# EAGLE design schematic (EAGLE 9.6.2)
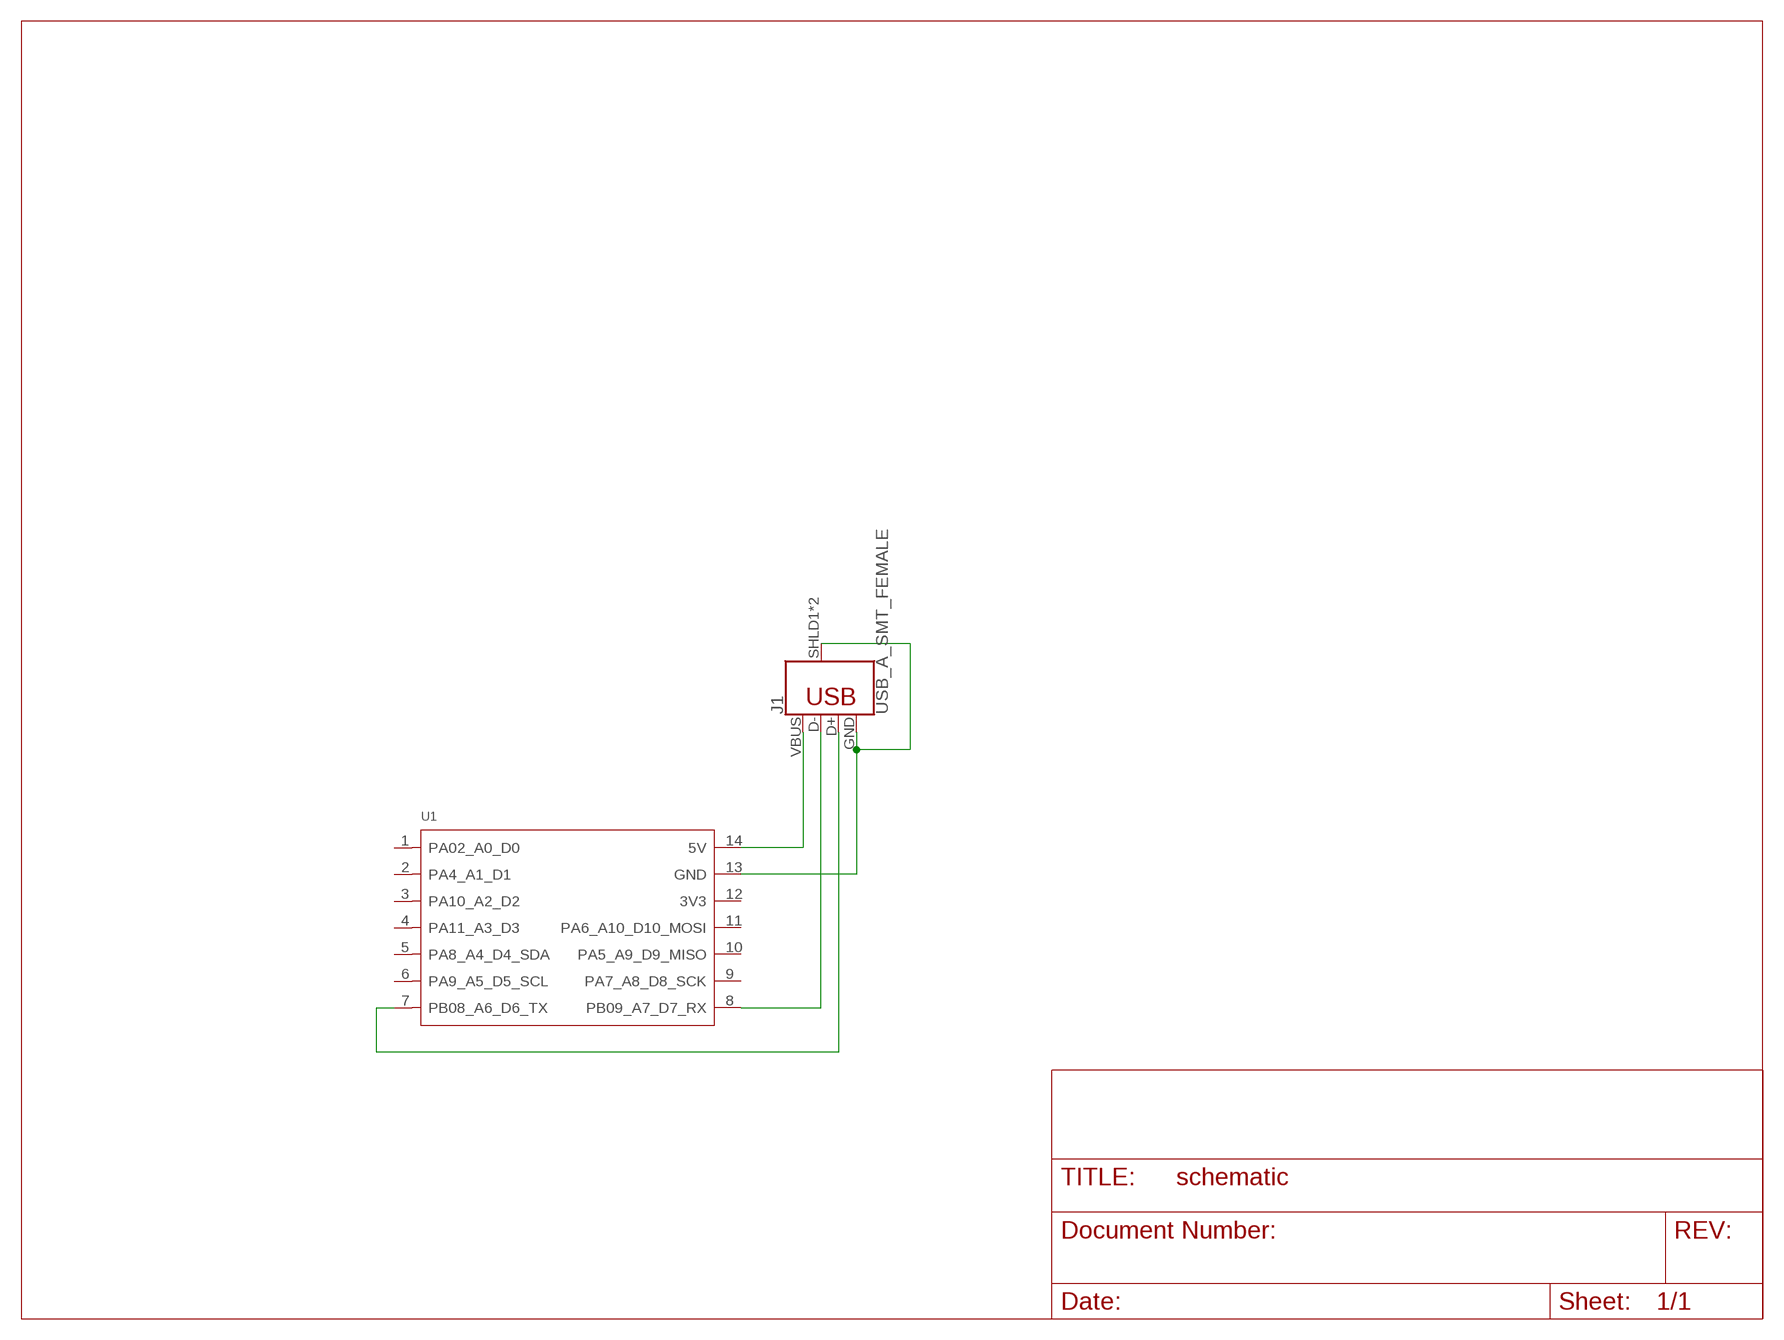
[diagram p0: schematic, sheet 1]

## Parts
J1  USB_A_SMT_FEMALE  [USB-A-S-SILK-FEMALE]
U1  MOUDLE-SEEEDUINO-XIAO  [MOUDLE14P-2.54-21X17.8MM]

## Nets
DATA_N [diff pairs]: J1.D- U1.8(PB09_A7_D7_RX)
DATA_P [diff pairs]: J1.D+ U1.7(PB08_A6_D6_TX)
GND [diff pairs]: J1.GND J1.SHLD1(SHIELD) J1.SHLD2(SHIELD) U1.13(GND)
VCC: J1.VBUS U1.14(5V)
Unconnected: U1.1(PA02_A0_D0) U1.2(PA4_A1_D1) U1.3(PA10_A2_D2) U1.4(PA11_A3_D3) U1.5(PA8_A4_D4_SDA) U1.6(PA9_A5_D5_SCL) U1.9(PA7_A8_D8_SCK) U1.10(PA5_A9_D9_MISO) U1.11(PA6_A10_D10_MOSI) U1.12(3V3)

## Library data of the parts
J1 = SparkFun-Connectors:USB_A: USB-A Connector Male and female variants, as well as PTH and SMT variants SparkFun Products: SparkFun XBee Explorer Dongle <https://www.sparkfun.com/products/11697> PTH Male SparkFun MicroView-USB Programmer <https://www.sparkfun.com/products/12924> SMT Male SparkFun USB Type A Female Breakout <https://www.sparkfun.com/products/12700> SMT Female; PROD_ID: CONN-09520; SF_ID: PRT-09011
U1 = Seeeduino XIAO:MOUDLE-SEEEDUINO-XIAO

## Net classes
1 diff pairs: width 0.406 mm

## Board
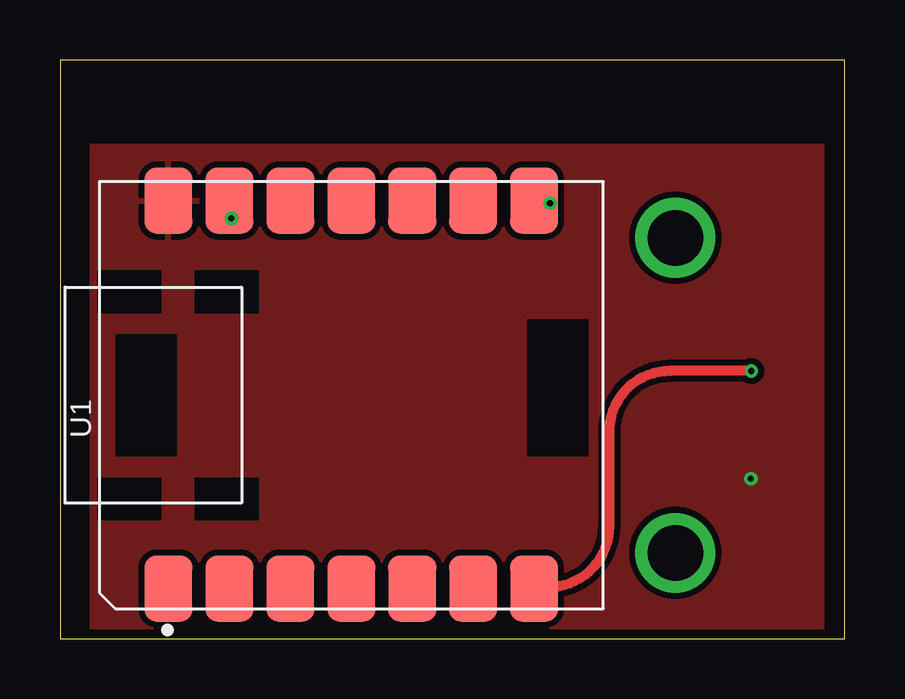
[diagram p1: board, top side]
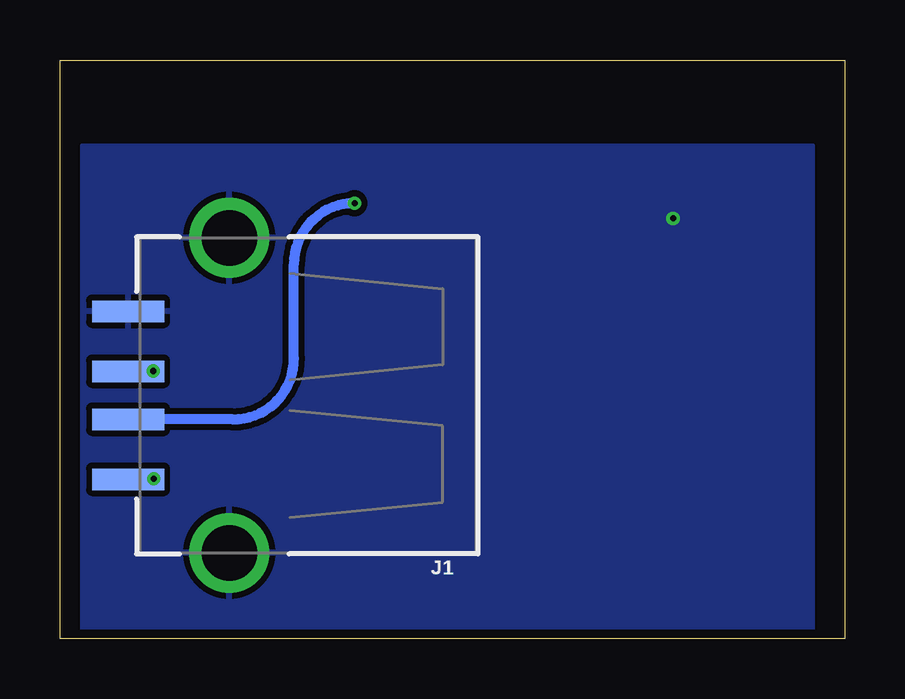
[diagram p2: board, bottom side, seen from below]

Size 32.69 x 24.12 mm. Coordinates in mm from the lower left corner, seen from the top.
Outline: 0,0 32.69,0 32.69,24.12 0,24.12 0,0
Copper layers (1*16): Top 0.035559375mm / dielectric 1.6mm / Bottom 0.035559375mm
Design rules "oshpark-2layer-auto-routing *": minimum track width 10mil, minimum drill 10mil, track to track 10mil, track to pad 8mil, pad to pad 8mil, via to via 8mil, smd to smd 6mil, copper to edge 15mil, drill to drill 6mil, minimum pad ring 6mil, minimum via ring 6mil, stop-mask expansion 2.5mil, vias tented up to drill 40mil, thermal gap 10mil

### Footprints (pad centres in the part's own frame; a part is rotated, then mirrored left to right if it is on the bottom)
USB-A-S-SILK-FEMALE = smd 3 x 0.9: D+ 7.212,-1; D- 7.212,1; GND 7.212,-3.5; VBUS 7.212,3.5 | drill 2.311: SHLD1 3,-6.566; SHLD2 3,6.566
MOUDLE14P-2.54-21X17.8MM = smd 2.75 x 2: 1 0.835,18.12; 2 0.835,15.58; 3 0.835,13.04; 4 0.835,10.5; 5 0.835,7.96; 6 0.835,5.42; 7 0.835,2.88; 8 17,2.88; 9 17,5.42; 10 17,7.96; 11 17,10.5; 12 17,13.04; 13 17,15.58; 14 17,18.12

### Placement (x,y rotation side)
J1  22.64,10.15 180 bottom
U1  22.64,1.26 90 top

### Tracks (layer width: path | path; a pad name or v marks a point on that pad's centre or on a via)
DATA_N  (via drill 0.25)
  Top 0.406: v20.41,18.15 20.31,18.26 U1.8
  Bottom 0.406: 28.87,9.13 29.75,9.13 J1.D- | v20.41,18.15 20.4,18.15 20.4,18.16 arc-90 22.94,15.62 22.94,11.68 arc90 25.48,9.14 28.87,9.14 28.87,9.13 | 28.87,9.13 28.65,9.13
DATA_P  (via drill 0.25)
  Top 0.406: U1.7 19.84,2.15 20.34,2.15 arc90 22.88,4.68 22.88,8.62 arc-90 25.41,11.16 v28.8,11.16
  Bottom 0.406: v28.8,11.16 28.93,11.04 29.75,11.04 J1.D+
GND  (via drill 0.25)
  Top 0.406: v7.14,17.52 7.14,18.15 U1.13
  pour Bottom: 1.3,20.56 1.3,0.24 31.78,0.24 31.78,20.56
VCC  (via drill 0.25)
  Bottom 0.254: J1.VBUS 29.82,6.67 v28.79,6.67
  pour Top: 1.3,20.56 1.3,0.24 31.78,0.24 31.78,20.56